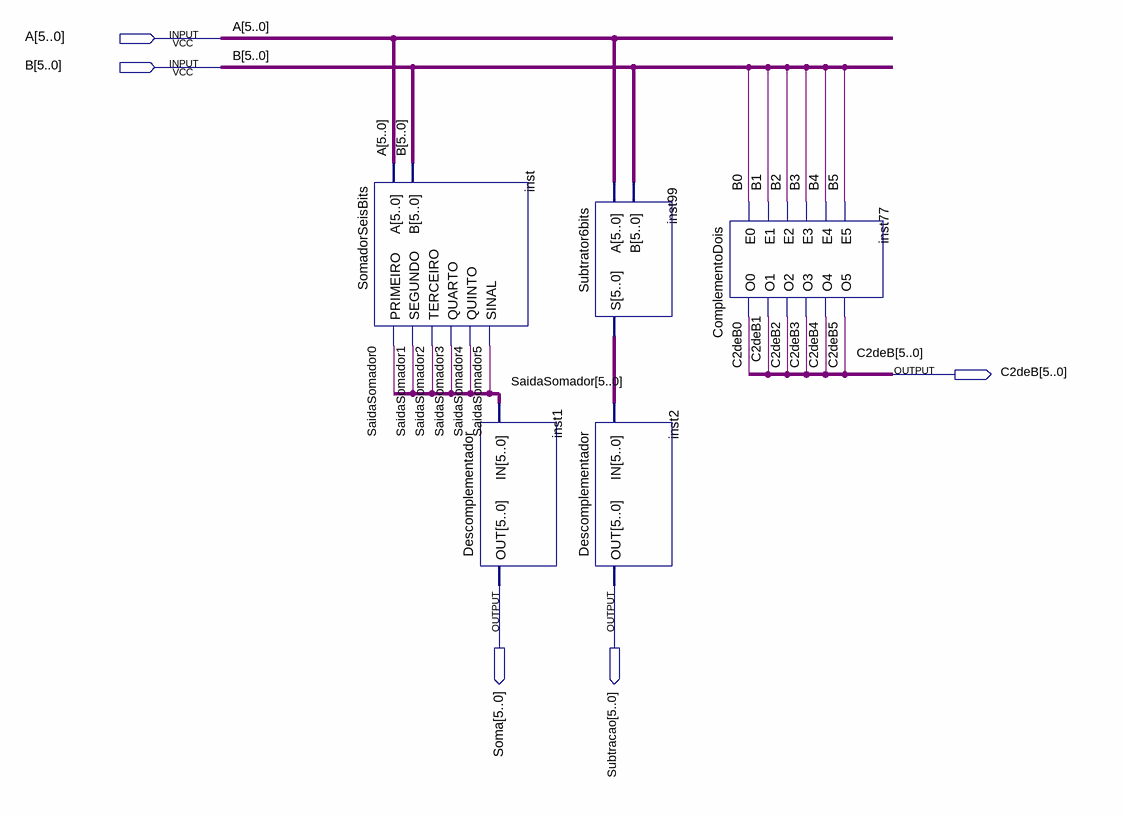
[diagram p0: schematic sheet]
// Quartus schematic UnidadeAritmetica.bdf as structural Verilog: 5 symbols, 5 pins
module UnidadeAritmetica (
  input  [5:0] A,
  input  [5:0] B,
  output [5:0] C2deB,
  output [5:0] Soma,
  output [5:0] Subtracao
);

  wire [5:0] inst99_s, SaidaSomador;

  SomadorSeisBits inst (
    .A(A), .B(B), .PRIMEIRO(SaidaSomador[0]), .SEGUNDO(SaidaSomador[1]), .TERCEIRO(SaidaSomador[2]),
    .QUARTO(SaidaSomador[3]), .QUINTO(SaidaSomador[4]), .SINAL(SaidaSomador[5]));
  Descomplementador inst1 (.IN(SaidaSomador), .OUT(Soma));
  Subtrator6bits inst99 (.A(A), .B(B), .S(inst99_s));
  Descomplementador inst2 (.IN(inst99_s), .OUT(Subtracao));
  ComplementoDois inst77 (
    .E0(B[0]), .E1(B[1]), .E2(B[2]), .E3(B[3]), .E4(B[4]), .E5(B[5]), .O0(C2deB[0]), .O1(C2deB[1]),
    .O2(C2deB[2]), .O3(C2deB[3]), .O4(C2deB[4]), .O5(C2deB[5]));
endmodule
